# Altium schematic sheet VoltageRegulator_3v3.SchDoc
size A; SheetNumber: 6; SheetTotal: 10
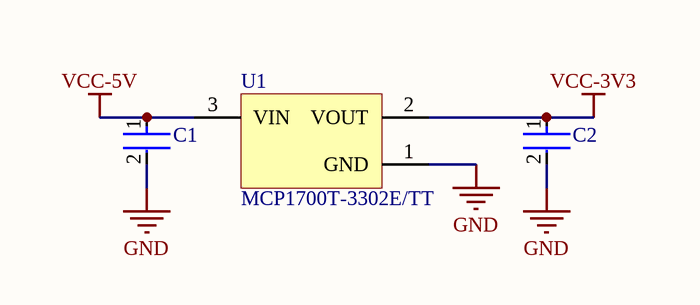
[diagram p0: VoltageRegulator_3v3.SchDoc]

## Parts
C1  CL10A105KO8NNNC  [FP-CL10-IPC_A]  (value not drawn)
C2  CL10A105KO8NNNC  [FP-CL10-IPC_A]  (value not drawn)
U1  MCP1700T-3302E/TT  [SOT-23-TT3_N]

## Nets
GND: C1.2 C2.2 U1.1(GND)
VCC-3V3: C2.1 U1.2(VOUT)
VCC-5V: C1.1 U1.3(VIN)

## Library data of the parts
C1 C2 = CMP-13271-001457-1: Cap Ceramic 1uF 16V X5R ±10% Pad SMD 0603 +85°C T/R; Dielectric: X5R; Height: 0.8mm; Capacitance: 1uF; Mount: Surface Mount; Thickness: 0.035inch; Width: 0.031inch; Min Operating Temperature: -55°C; Contact Plating: Tin; Case Code (Imperial): 0603; Depth: 0.8mm; Length: 1.6mm; Max Operating Temperature: 85°C; Packaging: Tape and Reel; Tolerance: 10%; Radiation Hardening: No; Case/Package: 0603; Package Quantity: 1; Voltage Rating: 16V; Case Code (Metric): 1608; Voltage: 16V; Material: Ceramic; Lead Free: Lead Free; Voltage Rating (DC): 16V
U1 = CMP-0136-00791-1: Low Quiescent Current LDO, 3-Pin SOT-23, Extended Temperature, Tape and Reel; PackageVersion: revBB, Aug-2009; Code_IPC: SOT23-3; PackageReference: SOT-23-TT3; DatasheetVersion: revB, Feb-2007; PackageDescription: 3-Lead Plastic Small Outline Transistor (TT) [SOT-23]